# EasyEDA Pro project ProProject_zelda_guardian.epro, board head_sub_pcb
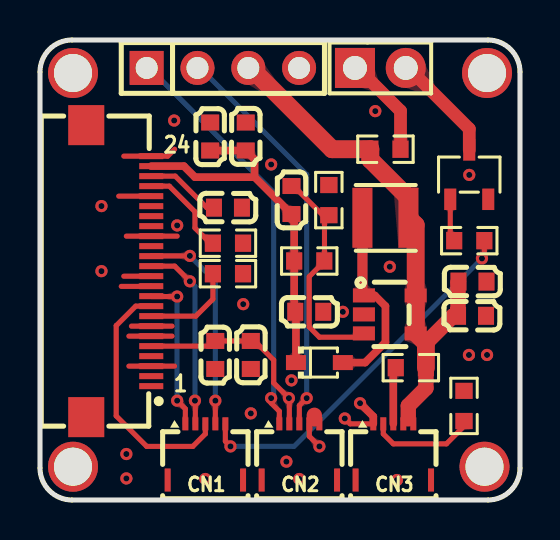
[diagram p6: board, top side]
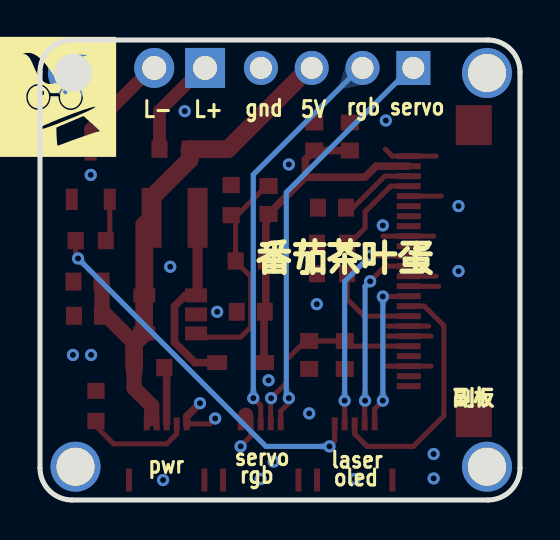
[diagram p7: board, bottom side, seen from below]

Outline 24 x 23 mm; copper layers: Top Layer, Bottom Layer. Coordinates in mm from the lower left corner of the outline.
Outline path: 0,21.4 0,1.6 arc(0.47,0.47) 1.6,0 22.4,0 arc(23.53,0.47) 24,1.6 24,21.4 arc(23.53,22.53) 22.4,23 1.6,23 arc(0.47,22.53) 0,21.4
Stack: Top Layer 0.035mm / Dielectric1 1.51mm FR4 er 4.5 / Bottom Layer 0.035mm

## Design rules (mm)
template: JLCPCB Capability(Two Layers Board)
spacing copperThickness1oz (default): track to track 0.102, other pairs 0.152 to 0.3
spacing copperThickness2oz: track to track 0.203, other pairs 0.152 to 0.3
track width copperThickness1oz (default): min 0.127, default 0.254, max 2.54
track width copperThickness2oz: min 0.203, default 0.254, max 2.54
differential pair differentialPair (default): width min 0.127, default 0.254, max 2.54; gap min 0.152, default 0.152
via viaSize (default): diameter min 0.5, default 0.61, max 10; hole min 0.3, default 0.305, max 6.3

## Placement (name value [footprint] x y rotation side)
C1  2.2uF  [C0603]  9.4 14.62 0 top
C2  100nF  [C0603]  8.76 7.25 90 top
C3  4.7uF  [C0603]  10.54 7.25 270 top
C4  100nF  [C0603]  10.29 18.17 270 top
C5  4.7uF  [C0603]  8.51 18.17 90 top
C7  22pF  [C0603]  12.57 15 270 top
C8  1uF  [C0603]  13.46 9.41 180 top
C9  100nF  [C0603]  21.6 9.21 0 top
C10  4.7uF  [C0603]  21.62 10.92 0 top
CN1  0.5K-QX-5PWB  [FPC-SMD_5P-P0.50_HDGC_0.5K-QX-5PWB]  8.27 2.4 0 top
CN2  0.5K-QX-5PWB  [FPC-SMD_5P-P0.50_HDGC_0.5K-QX-5PWB]  12.97 2.4 0 top
CN3  0.5K-QX-5PWB  [FPC-SMD_5P-P0.50_HDGC_0.5K-QX-5PWB]  17.67 2.4 0 top
FPC1  FPC-05FB-24PH20  [FPC-SMD_24P-P0.50_FPC-05FB-24PH20]  3.94 11.44 270 top
H1  PZ254V-11-04P  [HDR-TH_4P-P2.54-V-M]  9.14 21.6 0 top
H2  PZ254V-11-02P  [HDR-TH_2P-P2.54-V-M]  17.02 21.6 0 top
L1  10uH  [IND-SMD_L3.0-W3.0_SWPA3010S]  17.27 14.11 0 top
NOREF  -  [Pad_e43]  22.22 1.66 0 top
NOREF#2  -  [Pad_e42]  1.65 1.66 0 top
NOREF#3  -  [Pad_e47]  22.35 21.35 0 top
NOREF#4  -  [Pad_e48]  1.65 21.35 0 top
Q1  AO3400A  [SOT-23-3_L2.9-W1.6-P1.90-LS2.8-BR]  21.46 16.27 270 top
R1  750kΩ  [R0603]  9.4 12.84 180 top
R2  270kΩ  [R0603]  14.44 15 270 top
R3  0Ω  [R0603]  18.54 6.62 180 top
R4  0Ω  [R0603]  21.2 4.7 270 top
R5  2MΩ  [R0603]  13.46 11.95 180 top
R6  1kΩ  [R0603]  21.46 12.97 180 top
R7  0Ω  [R0603]  9.4 11.32 180 top
R8  0Ω  [R0603]  17.27 17.54 0 top
U2  1N4148WS  [SOD-323_L1.8-W1.3-LS2.5-RD]  13.97 6.87 0 top
U3  AP3012KTR-E1  [TSOT-23-5_L2.9-W1.6-P0.95-LS2.8-BR]  17.49 9.28 180 top

## Footprints (pads in the part's own frame, mm; a bottom-side part is the same pattern mirrored in y, then rotated)
C0603
  rect 0.8x0.9 smd: 1(-0.7,0) 2(0.7,0)
FPC-SMD_5P-P0.50_HDGC_0.5K-QX-5PWB
  rect 0.3x0.65 smd: 1(-1,1.405) 2(-0.5,1.405) 3(0,1.405) 4(0.5,1.405) 5(1,1.405)
  rect 0.3x1.15 smd: 6(1.885,-1.405) 7(-1.885,-1.405)
FPC-SMD_24P-P0.50_FPC-05FB-24PH20
  rect 0.3x1.2 smd: 1(5.75,1.625) 2(5.25,1.625) 3(4.75,1.625) 4(4.25,1.625) 5(3.75,1.625) 6(3.25,1.625) 7(2.75,1.625) 8(2.25,1.625) 9(1.75,1.625) 10(1.25,1.625) 11(0.75,1.625) 12(0.25,1.625) 13(-0.25,1.625) 14(-0.75,1.625) 15(-1.25,1.625) 16(-1.75,1.625) 17(-2.25,1.625) 18(-2.75,1.625) 19(-3.25,1.625) 20(-3.75,1.625) 21(-4.25,1.625) 22(-4.75,1.625) 23(-5.25,1.625) 24(-5.75,1.625)
  rect 2x1.8 smd: 25(-7.3,-1.625) 26(7.3,-1.625)
HDR-TH_2P-P2.54-V-M
  rect 2x2 hole 1.2: 1(-1.27,0)
  round 2 hole 1.2: 2(1.27,0)
HDR-TH_4P-P2.54-V-M
  rect 1.7x1.7 hole 1.1: 1(-3.81,0)
  round 1.7 hole 1.1: 2(-1.27,0) 3(1.27,0) 4(3.81,0)
IND-SMD_L3.0-W3.0_SWPA3010S
  rect 1x3 smd: 1(1.15,0) 2(-1.15,0)
Pad_e42
  round 2.5 hole 1.905: 3(0,0)
Pad_e43
  round 2.5 hole 1.905: 4(0,0)
Pad_e47
  round 2.5 hole 1.905: 2(0,0)
Pad_e48
  round 2.5 hole 1.905: 1(0,0)
R0603
  rect 0.806x0.864 smd: 1(-0.753,0) 2(0.753,0)
SOD-323_L1.8-W1.3-LS2.5-RD
  rect 1x0.75 smd: 1(-1.173,0) 2(1.173,0)
SOT-23-3_L2.9-W1.6-P1.90-LS2.8-BR
  rect 1.07x0.6 smd: 1(1.235,-0.95) 2(1.235,0.95) 3(-1.235,0)
TSOT-23-5_L2.9-W1.6-P0.95-LS2.8-BR
  rect 1.1x0.7 smd: 1(1.294,-0.951) 2(1.294,-0.001) 3(1.294,0.951) 4(-1.294,0.951) 5(-1.294,-0.949)

## Nets
As in the schematic, except:
RSV1': CN3.2 R4.2
RSV2': CN3.3 R3.2

Pads without a net: FPC1 4 15; NOREF 4; NOREF#2 3; NOREF#3 2; NOREF#4 1

## Via types
v1: diameter 0.61, hole 0.305, Top Layer to Bottom Layer, 34 vias

## Routing (per net, layer and track width the routed paths; a pad name or vN(x,y) marks a point on that pad's centre or on a via; arc(x,y) is an arc through that point)
3V3: length 10.1
  Top Layer w0.254: FPC1.5 8.5,7.69 C2.2 C3.1 10.73,7.95 11.68,7 11.68,5.86 v1(12.45,5.09) 12.47,5.07 CN2.2
+5V: length 26.7
  Top Layer w0.635: 18.8,8.34 18.78,8.33
  Top Layer w0.762: R3.1 19.3,5.59 18.41,4.71 18.41,4.06 ; 19.3,7.84 20.66,9.21 C9.1 20.9,10.9 C10.1
  Top Layer w0.889: 10.41,21.73 14.6,17.54 R8.1 16.52,17.01 18.42,15.11 L1.1 18.78,13.75 U3.5 18.8,10.22 18.8,8.34 19.3,7.84 R3.1
GND: length 20.6
  Top Layer w0.254: 6.86,13.19 FPC1.16 4.32,13.19 ; 4.57,8.69 FPC1.7 6.6,8.69 ; CN2.4 13.47,3.18 v1(13.97,2.68) ; 4.44,6.69 FPC1.3 6.73,6.69 ; FPC1.12 5.56,11.19 4.19,11.19 ; 4.06,10.68 5.55,10.68 FPC1.11 ; 4.44,8.19 FPC1.6 6.6,8.19 ; 4.19,17.19 FPC1.24 6.38,17.19 6.73,17.54 ; CN3.1 15.51,3.81 v1(15.24,4.08) ; FPC1.20 3.94,15.19
  Top Layer w0.381: v1(16,4.84) 16.67,4.18 CN3.1
  Top Layer w0.762: 13.72,4.06 13.72,4.24
  vias: v1(3.07,14.7) v1(3.07,11.44) v1(4.32,2.3) v1(4.32,1.08) v1(6.71,18.97) v1(6.86,13.73) v1(8.27,1.05) v1(10.16,9.79) v1(10.54,4.33) v1(11.56,16.78) v1(12.32,1.92) v1(12.57,5.98) v1(12.97,1.05) v1(15.14,9.41) v1(16.76,19.44) v1(17.49,11.66) v1(17.85,1) v1(21.45,7.25) v1(21.46,16.25) v1(22.35,7.25)
CLK: length 9.5
  Top Layer w0.254: v1(7.75,4.97) 7.77,4.95 CN1.2 ; FPC1.13 6.74,11.69 v1(7.49,10.94)
  Bottom Layer w0.254: v1(7.75,4.97) 7.75,10.68 v1(7.49,10.94)
CS: length 4.7
  Top Layer w0.254: FPC1.8 7.79,9.19 8.64,10.05 R7.2
DATA: length 10.9
  Top Layer w0.254: CN1.4 v1(8.77,4.97) ; FPC1.14 5.57,12.2 v1(7.49,12.2)
  Bottom Layer w0.254: v1(8.77,4.97) 8.77,10.93 v1(7.49,12.2)
DC: length 7.8
  Top Layer w0.254: v1(6.86,4.97) 7.27,4.56 CN1.1 ; v1(6.86,10.17) 5.58,10.17 FPC1.10
  Bottom Layer w0.254: v1(6.86,4.97) v1(6.86,10.17)
DIN: length 20.3
  Top Layer w0.254: CN2.3 12.97,4.72 v1(13.34,5.09)
  Bottom Layer w0.254: v1(13.34,5.09) 13.34,16.27 7.87,21.73
LASER: length 18.6
  Top Layer w0.254: R6.1 22.22,12.2 v1(22.1,12.08) ; CN1.5 9.27,2.94 v1(9.53,2.68)
  Bottom Layer w0.254: v1(9.53,2.68) 12.7,2.68 v1(22.1,12.08)
OLED_HV: length 18.8
  Top Layer w0.381: 10.73,16.14 7.75,16.14 7.2,16.69 FPC1.23 ; 10.73,16.14 10.73,17.03 C4.2 C5.1 ; 10.73,16.14 12.57,14.3 12.57,14.05 12.71,13.91 R5.2 12.71,9.46 C8.2 12.8,9.38 U2.1
PWM: length 20.8
  Top Layer w0.254: CN2.1 11.97,4.44 11.56,4.85 v1(11.56,5.09)
  Bottom Layer w0.254: v1(11.56,5.09) 11.68,5.22 11.68,15.38 5.33,21.73
RST: length 12.5
  Top Layer w0.254: FPC1.9 4.78,9.69 3.81,8.72 3.81,4.2 5.33,2.68 7.64,2.68 8.27,3.31 CN1.3
RSV1': length 5.4
  Top Layer w0.254: CN3.2 17.17,3.31 17.66,2.81 20.32,2.81 21.2,3.69 R4.2
RSV2': length 2.9
  Top Layer w0.381: R3.2 17.67,6.49 CN3.3
$1N1034: length 3.8
  Top Layer w0.254: FPC1.22 6.76,16.19 8.34,14.62 C1.1
$1N1552: length 9.6
  Top Layer w0.381: U3.1 16.74,10.23 17.27,9.69 17.27,7.89 16.26,6.87 U2.2
  Top Layer w0.508: U3.1 16.12,10.3 L1.2
$1N1946: length 11.1
  Top Layer w0.254: 16.2,8.33 16.01,8.14 13.97,8.14 13.46,8.65 13.46,11.17 14.23,11.94 14.22,11.94 14.22,14.15 12.68,15.7 C7.1
$1N5101: length 4.7
  Top Layer w0.254: FPC1.21 6.47,15.69 7.75,14.41 7.75,13.6 8.51,12.84 R1.2
$1N10250: length 2.1
  Top Layer w0.254: Q1.1 20.51,13.16 R6.2
$1N10268: length 5.5
  Top Layer w0.635: 18.29,21.73 21.46,18.56 Q1.3
$1N10317: length 5.1
  Top Layer w0.635: R8.2 18.03,19.45 15.75,21.73

## Copper pours and planes (outline as drawn; the poured copper is in the pictures)
GND on Top Layer: -2.54,25.54 24.26,25.54 24.26,-0.75 -2.54,-0.75
GND on Bottom Layer: -0.63,23.51 26.8,23.51 26.8,-2.91 -0.63,-2.91

Small or netless copper shapes (teardrops, artwork), in the pictures only: 88 on Top Layer, 12 on Bottom Layer

## Text on the board
Bottom Silkscreen Layer: servo | rgb | oled | laser | 5V | gnd | L+ | pwr | L- | 副板 | 番茄茶叶蛋
Top Silkscreen Layer: 24 | 1
